# Altium schematic sheet PicoZed.SchDoc: Pico Zed
size A2; DrawnBy: Patrik Staudenmayer; Organization: Altium Limited; Address1: L3, 12a Rodborough Rd; Address2: Frenchs Forest; Address3: NSW; Address4: Australia 2086; DocumentNumber: 3; SheetNumber: 3; SheetTotal: 15
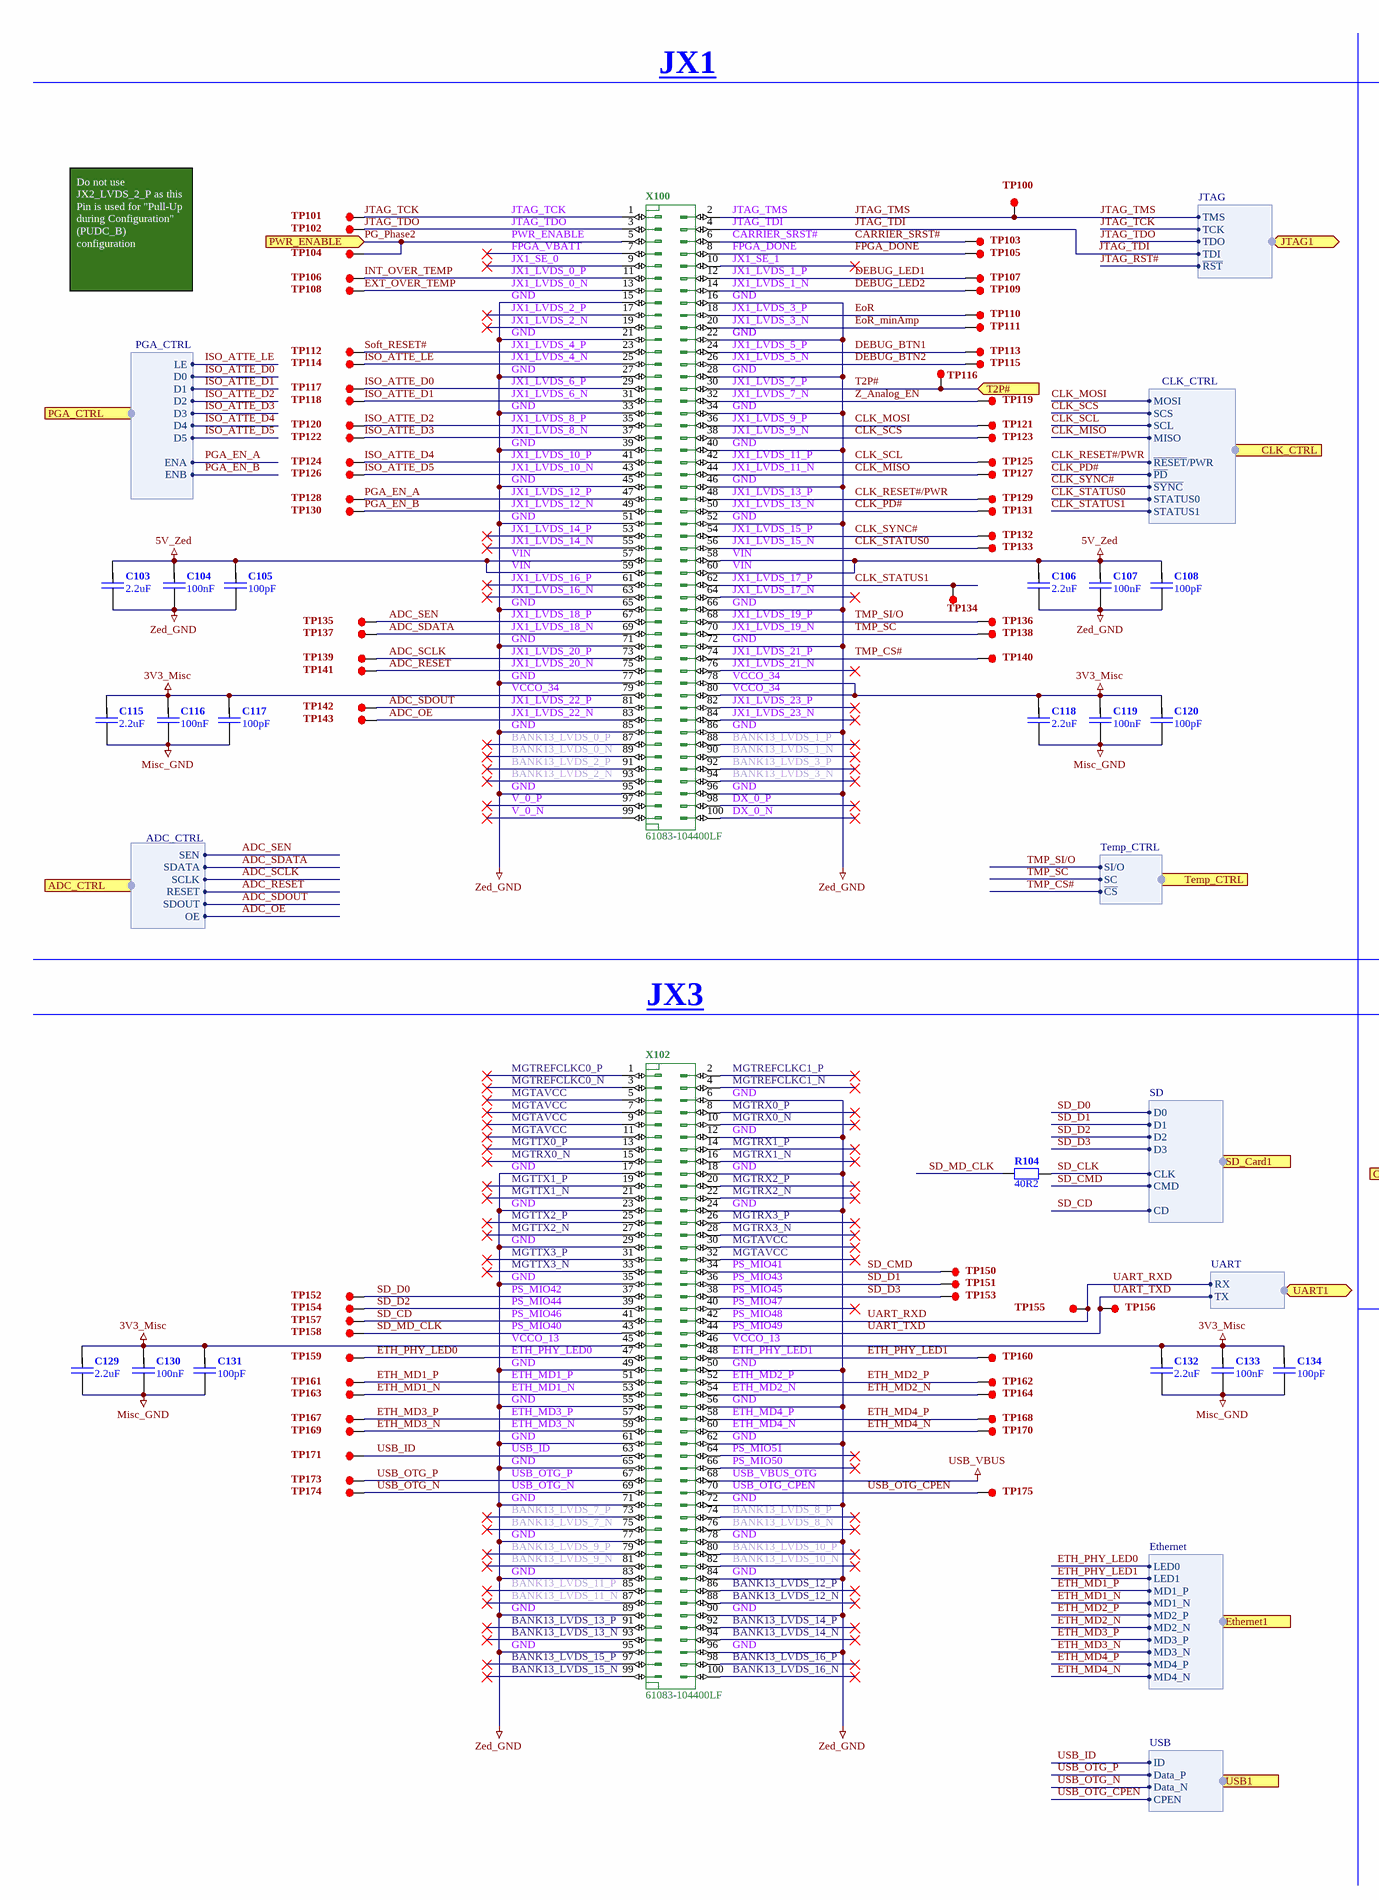
[diagram p0: PicoZed.SchDoc, left]
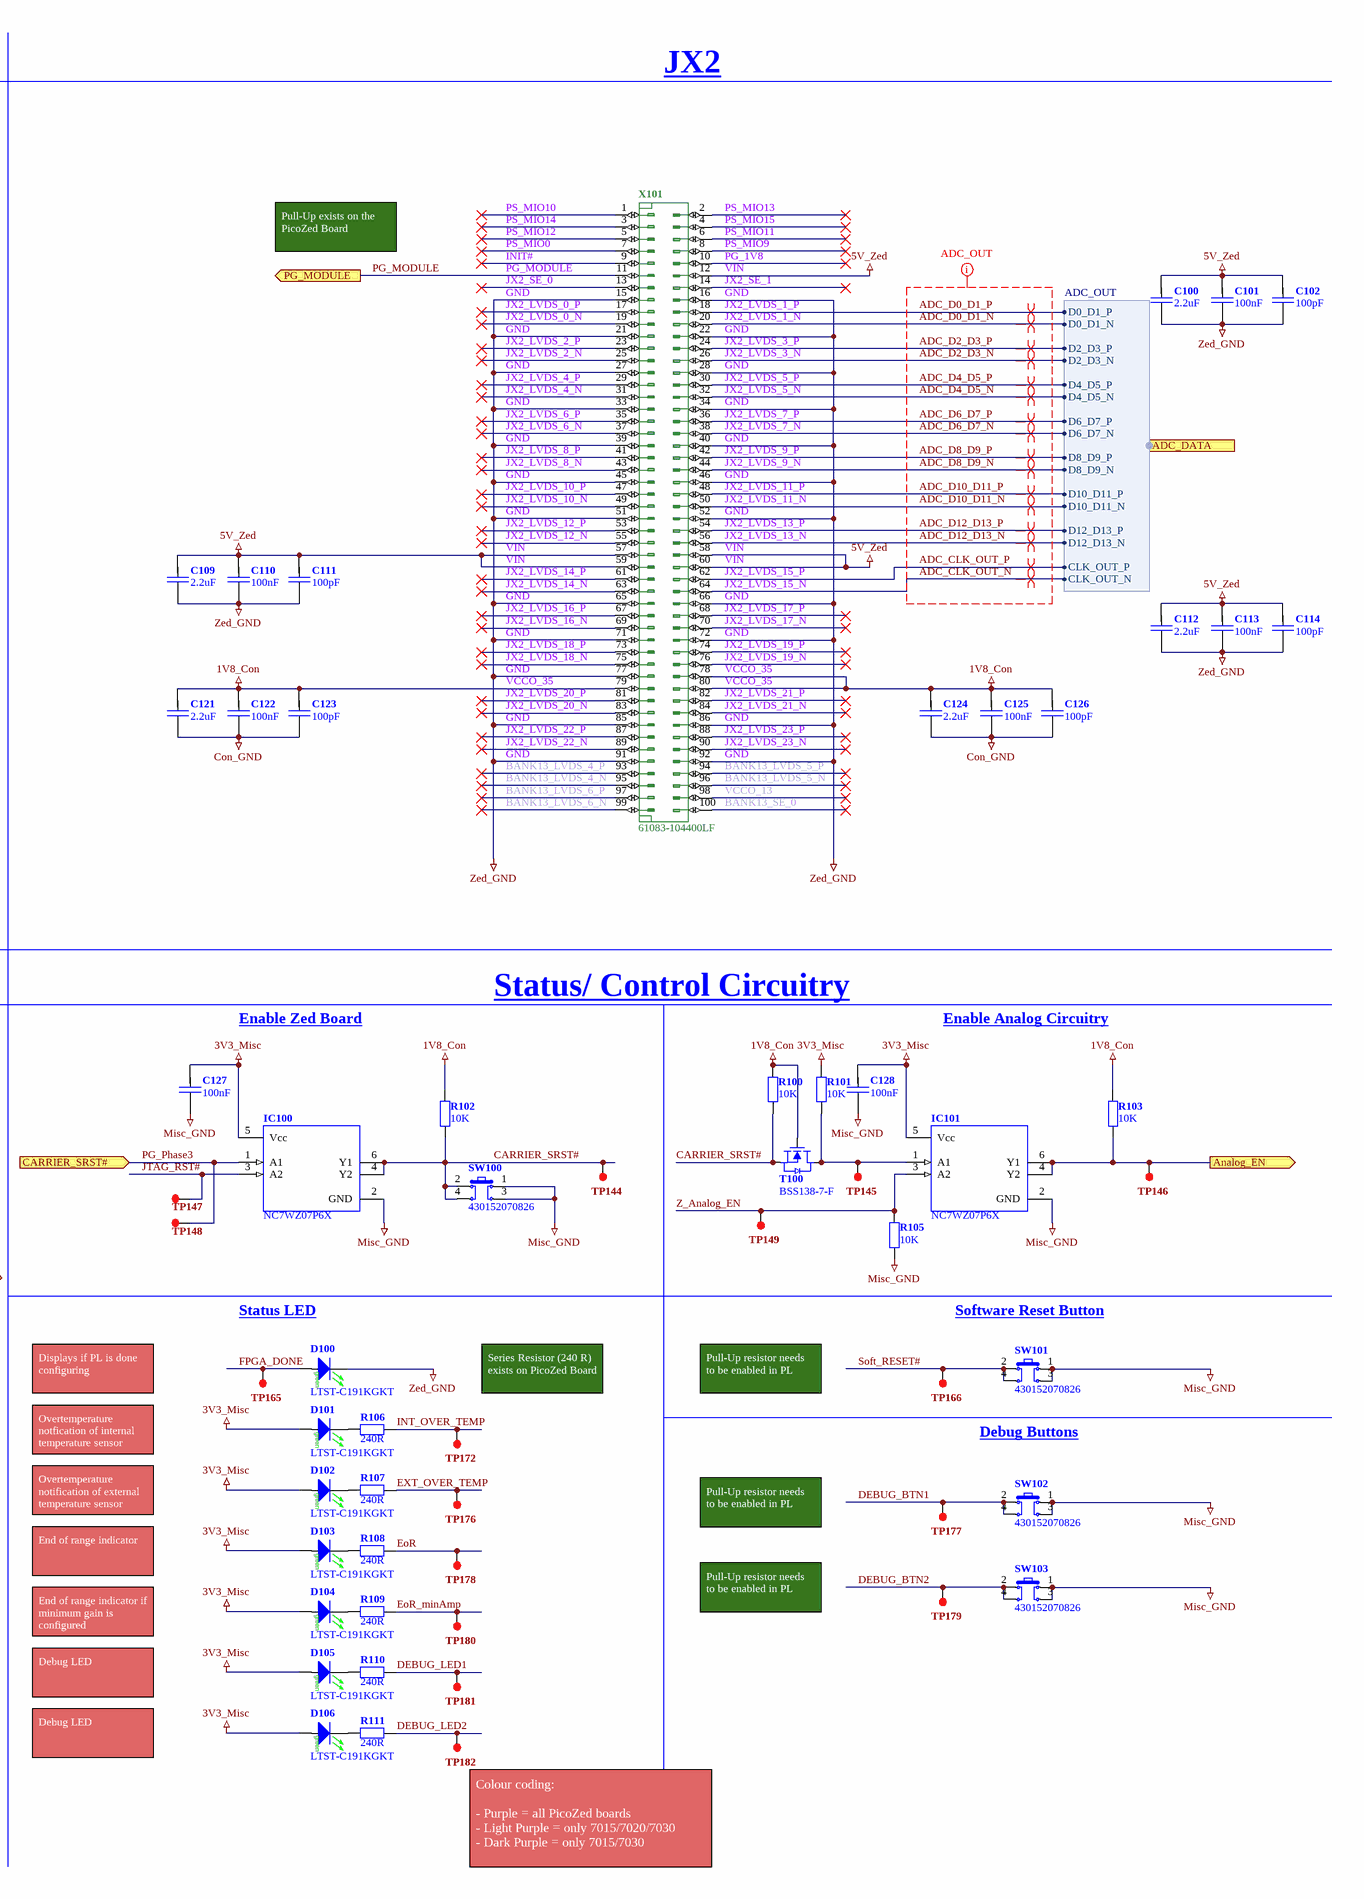
[diagram p1: PicoZed.SchDoc, right]

## Parts
C100  2.2uF  [C_1206_N [CAPC3216N IPC]]
C101  100nF  [C_0805_N [CAPC2013N IPC]]
C102  100pF  [C_0603_N [CAPC1608N IPC]]
C103  2.2uF  [C_1206_N [CAPC3216N IPC]]
C104  100nF  [C_0805_N [CAPC2013N IPC]]
C105  100pF  [C_0603_N [CAPC1608N IPC]]
C106  2.2uF  [C_1206_N [CAPC3216N IPC]]
C107  100nF  [C_0805_N [CAPC2013N IPC]]
C108  100pF  [C_0603_N [CAPC1608N IPC]]
C109  2.2uF  [C_1206_N [CAPC3216N IPC]]
C110  100nF  [C_0805_N [CAPC2013N IPC]]
C111  100pF  [C_0603_N [CAPC1608N IPC]]
C112  2.2uF  [C_1206_N [CAPC3216N IPC]]
C113  100nF  [C_0805_N [CAPC2013N IPC]]
C114  100pF  [C_0603_N [CAPC1608N IPC]]
C115  2.2uF  [C_1206_N [CAPC3216N IPC]]
C116  100nF  [C_0805_N [CAPC2013N IPC]]
C117  100pF  [C_0603_N [CAPC1608N IPC]]
C118  2.2uF  [C_1206_N [CAPC3216N IPC]]
C119  100nF  [C_0805_N [CAPC2013N IPC]]
C120  100pF  [C_0603_N [CAPC1608N IPC]]
C121  2.2uF  [C_1206_N [CAPC3216N IPC]]
C122  100nF  [C_0805_N [CAPC2013N IPC]]
C123  100pF  [C_0603_N [CAPC1608N IPC]]
C124  2.2uF  [C_1206_N [CAPC3216N IPC]]
C125  100nF  [C_0805_N [CAPC2013N IPC]]
C126  100pF  [C_0603_N [CAPC1608N IPC]]
C127  100nF  [C_0603_N [CAPC1608N IPC]]
C128  100nF  [C_0603_N [CAPC1608N IPC]]
C129  2.2uF  [C_1206_N [CAPC3216N IPC]]
C130  100nF  [C_0805_N [CAPC2013N IPC]]
C131  100pF  [C_0603_N [CAPC1608N IPC]]
C132  2.2uF  [C_1206_N [CAPC3216N IPC]]
C133  100nF  [C_0805_N [CAPC2013N IPC]]
C134  100pF  [C_0603_N [CAPC1608N IPC]]
D100  LTST-C191KGKT  [LED_0603-GREEN_N_AK]
D101  LTST-C191KGKT  [LED_0603-GREEN_N_AK]
D102  LTST-C191KGKT  [LED_0603-GREEN_N_AK]
D103  LTST-C191KGKT  [LED_0603-GREEN_N_AK]
D104  LTST-C191KGKT  [LED_0603-GREEN_N_AK]
D105  LTST-C191KGKT  [LED_0603-GREEN_N_AK]
D106  LTST-C191KGKT  [LED_0603-GREEN_N_AK]
IC100  NC7WZ07P6X  [TSOP65P210X110-6N IPC]
IC101  NC7WZ07P6X  [TSOP65P210X110-6N IPC]
R100  10K  [R_0603_N [RESC1608N IPC]]
R101  10K  [R_0603_N [RESC1608N IPC]]
R102  10K  [R_0603_N [RESC1608N IPC]]
R103  10K  [R_0603_N [RESC1608N IPC]]
R104  40R2  [R_0603_M [RESC1608M IPC]]
R105  10K  [R_0603_N [RESC1608N IPC]]
R106  240R  [R_0603_N [RESC1608N IPC]]
R107  240R  [R_0603_N [RESC1608N IPC]]
R108  240R  [R_0603_N [RESC1608N IPC]]
R109  240R  [R_0603_N [RESC1608N IPC]]
R110  240R  [R_0603_N [RESC1608N IPC]]
R111  240R  [R_0603_N [RESC1608N IPC]]
SW100  430152070826  [SW_430152070826]
SW101  430152070826  [SW_430152070826]
SW102  430152070826  [SW_430152070826]
SW103  430152070826  [SW_430152070826]
T100  BSS138-7-F  [SOT105P235X102-3N IPC]
TP100  TP_GENERIC  [TP_0.8_P100T]  (value not drawn)  (no BOM)
TP101  TP_GENERIC  [TP_0.8_P100T]  (value not drawn)  (no BOM)
TP102  TP_GENERIC  [TP_0.8_P100T]  (value not drawn)  (no BOM)
TP103  TP_GENERIC  [TP_0.8_P100T]  (value not drawn)  (no BOM)
TP104  TP_GENERIC  [TP_0.8_P100T]  (value not drawn)  (no BOM)
TP105  TP_GENERIC  [TP_0.8_P100T]  (value not drawn)  (no BOM)
TP106  TP_GENERIC  [TP_0.8_P100T]  (value not drawn)  (no BOM)
TP107  TP_GENERIC  [TP_0.8_P100T]  (value not drawn)  (no BOM)
TP108  TP_GENERIC  [TP_0.8_P100T]  (value not drawn)  (no BOM)
TP109  TP_GENERIC  [TP_0.8_P100T]  (value not drawn)  (no BOM)
TP110  TP_GENERIC  [TP_0.8_P100T]  (value not drawn)  (no BOM)
TP111  TP_GENERIC  [TP_0.8_P100T]  (value not drawn)  (no BOM)
TP112  TP_GENERIC  [TP_0.8_P100T]  (value not drawn)  (no BOM)
TP113  TP_GENERIC  [TP_0.8_P100T]  (value not drawn)  (no BOM)
TP114  TP_GENERIC  [TP_0.8_P100T]  (value not drawn)  (no BOM)
TP115  TP_GENERIC  [TP_0.8_P100T]  (value not drawn)  (no BOM)
TP116  TP_GENERIC  [TP_0.8_P100T]  (value not drawn)  (no BOM)
TP117  TP_GENERIC  [TP_0.8_P100T]  (value not drawn)  (no BOM)
TP118  TP_GENERIC  [TP_0.8_P100T]  (value not drawn)  (no BOM)
TP119  TP_GENERIC  [TP_0.8_P100T]  (value not drawn)  (no BOM)
TP120  TP_GENERIC  [TP_0.8_P100T]  (value not drawn)  (no BOM)
TP121  TP_GENERIC  [TP_0.8_P100T]  (value not drawn)  (no BOM)
TP122  TP_GENERIC  [TP_0.8_P100T]  (value not drawn)  (no BOM)
TP123  TP_GENERIC  [TP_0.8_P100T]  (value not drawn)  (no BOM)
TP124  TP_GENERIC  [TP_0.8_P100T]  (value not drawn)  (no BOM)
TP125  TP_GENERIC  [TP_0.8_P100T]  (value not drawn)  (no BOM)
TP126  TP_GENERIC  [TP_0.8_P100T]  (value not drawn)  (no BOM)
TP127  TP_GENERIC  [TP_0.8_P100T]  (value not drawn)  (no BOM)
TP128  TP_GENERIC  [TP_0.8_P100T]  (value not drawn)  (no BOM)
TP129  TP_GENERIC  [TP_0.8_P100T]  (value not drawn)  (no BOM)
TP130  TP_GENERIC  [TP_0.8_P100T]  (value not drawn)  (no BOM)
TP131  TP_GENERIC  [TP_0.8_P100T]  (value not drawn)  (no BOM)
TP132  TP_GENERIC  [TP_0.8_P100T]  (value not drawn)  (no BOM)
TP133  TP_GENERIC  [TP_0.8_P100T]  (value not drawn)  (no BOM)
TP134  TP_GENERIC  [TP_0.8_P100T]  (value not drawn)  (no BOM)
TP135  TP_GENERIC  [TP_0.8_P100T]  (value not drawn)  (no BOM)
TP136  TP_GENERIC  [TP_0.8_P100T]  (value not drawn)  (no BOM)
TP137  TP_GENERIC  [TP_0.8_P100T]  (value not drawn)  (no BOM)
TP138  TP_GENERIC  [TP_0.8_P100T]  (value not drawn)  (no BOM)
TP139  TP_GENERIC  [TP_0.8_P100T]  (value not drawn)  (no BOM)
TP140  TP_GENERIC  [TP_0.8_P100T]  (value not drawn)  (no BOM)
TP141  TP_GENERIC  [TP_0.8_P100T]  (value not drawn)  (no BOM)
TP142  TP_GENERIC  [TP_0.8_P100T]  (value not drawn)  (no BOM)
TP143  TP_GENERIC  [TP_0.8_P100T]  (value not drawn)  (no BOM)
TP144  TP_GENERIC  [TP_0.8_P100T]  (value not drawn)  (no BOM)
TP145  TP_GENERIC  [TP_0.8_P100T]  (value not drawn)  (no BOM)
TP146  TP_GENERIC  [TP_0.8_P100T]  (value not drawn)  (no BOM)
TP147  TP_GENERIC  [TP_0.8_P100T]  (value not drawn)  (no BOM)
TP148  TP_GENERIC  [TP_0.8_P100T]  (value not drawn)  (no BOM)
TP149  TP_GENERIC  [TP_0.8_P100T]  (value not drawn)  (no BOM)
TP150  TP_GENERIC  [TP_0.8_P100T]  (value not drawn)  (no BOM)
TP151  TP_GENERIC  [TP_0.8_P100T]  (value not drawn)  (no BOM)
TP152  TP_GENERIC  [TP_0.8_P100T]  (value not drawn)  (no BOM)
TP153  TP_GENERIC  [TP_0.8_P100T]  (value not drawn)  (no BOM)
TP154  TP_GENERIC  [TP_0.8_P100T]  (value not drawn)  (no BOM)
TP155  TP_GENERIC  [TP_0.8_P100T]  (value not drawn)  (no BOM)
TP156  TP_GENERIC  [TP_0.8_P100T]  (value not drawn)  (no BOM)
TP157  TP_GENERIC  [TP_0.8_P100T]  (value not drawn)  (no BOM)
TP158  TP_GENERIC  [TP_0.8_P100T]  (value not drawn)  (no BOM)
TP159  TP_GENERIC  [TP_0.8_P100T]  (value not drawn)  (no BOM)
TP160  TP_GENERIC  [TP_0.8_P100T]  (value not drawn)  (no BOM)
TP161  TP_GENERIC  [TP_0.8_P100T]  (value not drawn)  (no BOM)
TP162  TP_GENERIC  [TP_0.8_P100T]  (value not drawn)  (no BOM)
TP163  TP_GENERIC  [TP_0.8_P100T]  (value not drawn)  (no BOM)
TP164  TP_GENERIC  [TP_0.8_P100T]  (value not drawn)  (no BOM)
TP165  TP_GENERIC  [TP_0.8_P100T]  (value not drawn)  (no BOM)
TP166  TP_GENERIC  [TP_0.8_P100T]  (value not drawn)  (no BOM)
TP167  TP_GENERIC  [TP_0.8_P100T]  (value not drawn)  (no BOM)
TP168  TP_GENERIC  [TP_0.8_P100T]  (value not drawn)  (no BOM)
TP169  TP_GENERIC  [TP_0.8_P100T]  (value not drawn)  (no BOM)
TP170  TP_GENERIC  [TP_0.8_P100T]  (value not drawn)  (no BOM)
TP171  TP_GENERIC  [TP_0.8_P100T]  (value not drawn)  (no BOM)
TP172  TP_GENERIC  [TP_0.8_P100T]  (value not drawn)  (no BOM)
TP173  TP_GENERIC  [TP_0.8_P100T]  (value not drawn)  (no BOM)
TP174  TP_GENERIC  [TP_0.8_P100T]  (value not drawn)  (no BOM)
TP175  TP_GENERIC  [TP_0.8_P100T]  (value not drawn)  (no BOM)
TP176  TP_GENERIC  [TP_0.8_P100T]  (value not drawn)  (no BOM)
TP177  TP_GENERIC  [TP_0.8_P100T]  (value not drawn)  (no BOM)
TP178  TP_GENERIC  [TP_0.8_P100T]  (value not drawn)  (no BOM)
TP179  TP_GENERIC  [TP_0.8_P100T]  (value not drawn)  (no BOM)
TP180  TP_GENERIC  [TP_0.8_P100T]  (value not drawn)  (no BOM)
TP181  TP_GENERIC  [TP_0.8_P100T]  (value not drawn)  (no BOM)
TP182  TP_GENERIC  [TP_0.8_P100T]  (value not drawn)  (no BOM)
X100  61083-104400LF  [X_61083-104400LF]
X101  61083-104400LF  [X_61083-104400LF]
X102  61083-104400LF  [X_61083-104400LF]

## Ports
ADC_CTRL (harness ADC_CTRL), ADC_DATA (harness ADC_OUT), Analog_EN (out), CARRIER_SRST# (in), CLK_CTRL (harness CLK_CTRL), Ethernet1 (harness Ethernet), JTAG1 (bidir, harness JTAG), PG_MODULE (out), PGA_CTRL (harness PGA_CTRL), PWR_ENABLE (in), SD_Card1 (harness SD), T2P# (in), Temp_CTRL (in, harness Temp_CTRL), UART1 (bidir, harness UART), USB1 (harness USB)

## Harnesses
SD: CLK, D0, D1, D2, D3, CD, CMD
USB: ID, Data_P, Data_N, CPEN
Ethernet: LED0, LED1, MD1_P, MD1_N, MD2_P, MD2_N, MD3_P, MD3_N, MD4_P, MD4_N
JTAG: TMS, TCK, TDI, TDO, ~{RST}
UART: TX, RX
ADC_OUT: D0_D1_N, D0_D1_P, D2_D3_N, D2_D3_P, D4_D5_N, D4_D5_P, D6_D7_N, D6_D7_P, D8_D9_N, D8_D9_P, D10_D11_N, D10_D11_P, D12_D13_N, D12_D13_P, CLK_OUT_P, CLK_OUT_N
CLK_CTRL: MOSI, SCS, SCL, MISO, ~{RESET}/PWR, ~{PD}, ~{SYNC}, STATUS0, STATUS1
ADC_CTRL: SEN, SDATA, SCLK, RESET, SDOUT, OE
PGA_CTRL: LE, D0, D1, D2, D3, D4, D5, ENA, ENB
Temp_CTRL: SI/O, SC, ~{CS}

## Nets
1V8_Con: C121.1 C122.1 C123.1 C124.1 C125.1 C126.1 R100.2 R102.2 R103.2 T100.G X101.78 X101.79 X101.80
3V3_Misc: C115.1 C116.1 C117.1 C118.1 C119.1 C120.1 C127.1 C128.1 C129.1 C130.1 C131.1 C132.1 C133.1 C134.1 D101.A D102.A D103.A D104.A D105.A D106.A IC100.5(Vcc) IC101.5(Vcc) R101.2 X100.78 X100.79 X100.80 X102.45 X102.46
5V_Zed: C100.1 C101.1 C102.1 C103.1 C104.1 C105.1 C106.1 C107.1 C108.1 C109.1 C110.1 C111.1 C112.1 C113.1 C114.1 X100.57 X100.58 X100.59 X100.60 X101.12 X101.57 X101.58 X101.59 X101.60
Con_GND: C121.2 C122.2 C123.2 C124.2 C125.2 C126.2
Misc_GND: C115.2 C116.2 C117.2 C118.2 C119.2 C120.2 C127.2 C128.2 C129.2 C130.2 C131.2 C132.2 C133.2 C134.2 IC100.2(GND) IC101.2(GND) R105.1 SW100.1 SW100.3 SW101.1 SW101.3 SW102.1 SW102.3 SW103.1 SW103.3
USB_VBUS: X102.68
Zed_GND: C100.2 C101.2 C102.2 C103.2 C104.2 C105.2 C106.2 C107.2 C108.2 C109.2 C110.2 C111.2 C112.2 C113.2 C114.2 D100.K X100.15 X100.16 X100.21 X100.22 X100.27 X100.28 X100.33 X100.34 X100.39 X100.40 X100.45 X100.46 X100.51 X100.52 X100.65 X100.66 X100.71 X100.72 X100.77 X100.85 X100.86 X100.95 X100.96 X101.15 X101.16 X101.21 X101.22 X101.27 X101.28 X101.33 X101.34 X101.39 X101.40 X101.45 X101.46 X101.51 X101.52 X101.65 X101.66 X101.71 X101.72 X101.77 X101.85 X101.86 X101.91 X101.92 X102.6 X102.12 X102.17 X102.18 X102.23 X102.24 X102.29 X102.35 X102.49 X102.50 X102.55 X102.56 X102.61 X102.62 X102.65 X102.71 X102.72 X102.77 X102.78 X102.83 X102.84 X102.89 X102.90 X102.95 X102.96
ADC_CLK_OUT_N: X101.64 ; port ADC_DATA.CLK_OUT_N
ADC_CLK_OUT_P: X101.62 ; port ADC_DATA.CLK_OUT_P
ADC_D0_D1_N: X101.20 ; port ADC_DATA.D0_D1_N
ADC_D0_D1_P: X101.18 ; port ADC_DATA.D0_D1_P
ADC_D2_D3_N: X101.26 ; port ADC_DATA.D2_D3_N
ADC_D2_D3_P: X101.24 ; port ADC_DATA.D2_D3_P
ADC_D4_D5_N: X101.32 ; port ADC_DATA.D4_D5_N
ADC_D4_D5_P: X101.30 ; port ADC_DATA.D4_D5_P
ADC_D6_D7_N: X101.38 ; port ADC_DATA.D6_D7_N
ADC_D6_D7_P: X101.36 ; port ADC_DATA.D6_D7_P
ADC_D8_D9_N: X101.44 ; port ADC_DATA.D8_D9_N
ADC_D8_D9_P: X101.42 ; port ADC_DATA.D8_D9_P
ADC_D10_D11_N: X101.50 ; port ADC_DATA.D10_D11_N
ADC_D10_D11_P: X101.48 ; port ADC_DATA.D10_D11_P
ADC_D12_D13_N: X101.56 ; port ADC_DATA.D12_D13_N
ADC_D12_D13_P: X101.54 ; port ADC_DATA.D12_D13_P
ADC_OE: TP143.1 X100.83 ; port ADC_CTRL.OE
ADC_RESET: TP141.1 X100.75 ; port ADC_CTRL.RESET
ADC_SCLK: TP139.1 X100.73 ; port ADC_CTRL.SCLK
ADC_SDATA: TP137.1 X100.69 ; port ADC_CTRL.SDATA
ADC_SDOUT: TP142.1 X100.81 ; port ADC_CTRL.SDOUT
ADC_SEN: TP135.1 X100.67 ; port ADC_CTRL.SEN
Analog_EN: IC101.4(Y2) IC101.6(Y1) R103.1 TP146.1 ; port Analog_EN
CARRIER_SRST#: IC100.4(Y2) IC100.6(Y1) R100.1 R102.1 SW100.2 SW100.4 T100.S TP103.1 TP144.1 X100.6
CLK_MISO: TP127.1 X100.44 ; port CLK_CTRL.MISO
CLK_MOSI: TP121.1 X100.36 ; port CLK_CTRL.MOSI
CLK_PD#: TP131.1 X100.50 ; port CLK_CTRL.~{PD}
CLK_RESET#/PWR: TP129.1 X100.48 ; port CLK_CTRL.~{RESET}/PWR
CLK_SCL: TP125.1 X100.42 ; port CLK_CTRL.SCL
CLK_SCS: TP123.1 X100.38 ; port CLK_CTRL.SCS
CLK_STATUS0: TP133.1 X100.56 ; port CLK_CTRL.STATUS0
CLK_STATUS1: TP134.1 X100.62 ; port CLK_CTRL.STATUS1
CLK_SYNC#: TP132.1 X100.54 ; port CLK_CTRL.~{SYNC}
DEBUG_BTN1: SW102.2 SW102.4 TP113.1 TP177.1 X100.24
DEBUG_BTN2: SW103.2 SW103.4 TP115.1 TP179.1 X100.26
DEBUG_LED1: R110.1 TP107.1 TP181.1 X100.12
DEBUG_LED2: R111.1 TP109.1 TP182.1 X100.14
EoR: R108.1 TP110.1 TP178.1 X100.18
EoR_minAmp: R109.1 TP111.1 TP180.1 X100.20
ETH_MD1_N: TP163.1 X102.53 ; port Ethernet1.MD1_N
ETH_MD1_P: TP161.1 X102.51 ; port Ethernet1.MD1_P
ETH_MD2_N: TP164.1 X102.54 ; port Ethernet1.MD2_N
ETH_MD2_P: TP162.1 X102.52 ; port Ethernet1.MD2_P
ETH_MD3_N: TP169.1 X102.59 ; port Ethernet1.MD3_N
ETH_MD3_P: TP167.1 X102.57 ; port Ethernet1.MD3_P
ETH_MD4_N: TP170.1 X102.60 ; port Ethernet1.MD4_N
ETH_MD4_P: TP168.1 X102.58 ; port Ethernet1.MD4_P
ETH_PHY_LED0: TP159.1 X102.47 ; port Ethernet1.LED0
ETH_PHY_LED1: TP160.1 X102.48 ; port Ethernet1.LED1
EXT_OVER_TEMP: R107.1 TP108.1 TP176.1 X100.13
FPGA_DONE: D100.A TP105.1 TP165.1 X100.8
INT_OVER_TEMP: R106.1 TP106.1 TP172.1 X100.11
ISO_ATTE_D0: TP117.1 X100.29 ; port PGA_CTRL.D0
ISO_ATTE_D1: TP118.1 X100.31 ; port PGA_CTRL.D1
ISO_ATTE_D2: TP120.1 X100.35 ; port PGA_CTRL.D2
ISO_ATTE_D3: TP122.1 X100.37 ; port PGA_CTRL.D3
ISO_ATTE_D4: TP124.1 X100.41 ; port PGA_CTRL.D4
ISO_ATTE_D5: TP126.1 X100.43 ; port PGA_CTRL.D5
ISO_ATTE_LE: TP114.1 X100.25 ; port PGA_CTRL.LE
JTAG_RST#: IC100.3(A2) TP147.1 ; port JTAG1.~{RST}
JTAG_TCK: TP101.1 X100.1 ; port JTAG1.TCK
JTAG_TDI: X100.4 ; port JTAG1.TDI
JTAG_TDO: TP102.1 X100.3 ; port JTAG1.TDO
JTAG_TMS: TP100.1 X100.2 ; port JTAG1.TMS
PG_MODULE: X101.11 ; port PG_MODULE
PG_Phase2: TP104.1 X100.5 ; port PWR_ENABLE
PG_Phase3: IC100.1(A1) TP148.1 ; port CARRIER_SRST#
PGA_EN_A: TP128.1 X100.47 ; port PGA_CTRL.ENA
PGA_EN_B: TP130.1 X100.49 ; port PGA_CTRL.ENB
SD_CD: TP157.1 X102.41 ; port SD_Card1.CD
SD_CLK: R104.1 ; port SD_Card1.CLK
SD_CMD: TP150.1 X102.34 ; port SD_Card1.CMD
SD_D0: TP152.1 X102.37 ; port SD_Card1.D0
SD_D1: TP151.1 X102.36 ; port SD_Card1.D1
SD_D2: TP154.1 X102.39 ; port SD_Card1.D2
SD_D3: TP153.1 X102.38 ; port SD_Card1.D3
SD_MD_CLK: R104.2 TP158.1 X102.43
Soft_RESET#: SW101.2 SW101.4 TP112.1 TP166.1 X100.23
T2P#: TP116.1 X100.30 ; port T2P#
TMP_CS#: TP140.1 X100.74 ; port Temp_CTRL.~{CS}
TMP_SC: TP138.1 X100.70 ; port Temp_CTRL.SC
TMP_SI/O: TP136.1 X100.68 ; port Temp_CTRL.SI/O
UART_RXD: TP155.1 X102.42 ; port UART1.RX
UART_TXD: TP156.1 X102.44 ; port UART1.TX
USB_ID: TP171.1 X102.63 ; port USB1.ID
USB_OTG_CPEN: TP175.1 X102.70 ; port USB1.CPEN
USB_OTG_N: TP174.1 X102.69 ; port USB1.Data_N
USB_OTG_P: TP173.1 X102.67 ; port USB1.Data_P
Z_Analog_EN: IC101.3(A2) R105.2 TP119.1 TP149.1 X100.32
NetD101_K: D101.K R106.2
NetD102_K: D102.K R107.2
NetD103_K: D103.K R108.2
NetD104_K: D104.K R109.2
NetD105_K: D105.K R110.2
NetD106_K: D106.K R111.2
NetIC101_1: IC101.1(A1) R101.1 T100.D TP145.1

Not connected (* = marked no-connect by the designer): X100 7* 9* 10* 17* 19* 53* 55* 61* 63* 64* 76* 82* 84* 87* 88* 89* 90* 91* 92* 93* 94* 97* 98* 99* 100*; X101 1* 2* 3* 4* 5* 6* 7* 8* 9* 10* 13* 14* 17* 19* 23* 25* 29* 31* 35* 37* 41* 43* 47* 49* 53* 55* 61* 63* 67* 68* 69* 70* 73* 74* 75* 76* 81* 82* 83* 84* 87* 88* 89* 90* 93* 94* 95* 96* 97* 98* 99* 100*; X102 1* 2* 3* 4* 5* 7* 8* 9* 10* 11* 13* 14* 15* 16* 19* 20* 21* 22* 25* 26* 27* 28* 30* 31* 32* 33* 40* 64* 66* 73* 74* 75* 76* 79* 80* 81* 82* 85* 86* 87* 88* 91* 92* 93* 94* 97* 98* 99* 100*

## Layout directives
differential pair: ADC_CLK_OUT_N, ADC_CLK_OUT_P, ADC_D0_D1_N, ADC_D0_D1_P, ADC_D2_D3_N, ADC_D2_D3_P, ADC_D4_D5_N, ADC_D4_D5_P, ADC_D6_D7_N, ADC_D6_D7_P, ADC_D8_D9_N, ADC_D8_D9_P, ADC_D10_D11_N, ADC_D10_D11_P, ADC_D12_D13_N, ADC_D12_D13_P
rule Maximum Via Count Constraint [Max Count = 2]; rule Differential Pairs Routing [Pref Gap = 5mil    Min Gap  = 5mil    Max Gap  = 5milPref Width = 4.138mil    Min Width  = 2.925mil    Max Width  = 4.138mil]; rule Matched Net Lengths [Tolerance = 25mil]; net class ADC_OUT: ADC_CLK_OUT_N, ADC_CLK_OUT_P, ADC_D0_D1_N, ADC_D0_D1_P, ADC_D2_D3_N, ADC_D2_D3_P, ADC_D4_D5_N, ADC_D4_D5_P, ADC_D6_D7_N, ADC_D6_D7_P, ADC_D8_D9_N, ADC_D8_D9_P, ADC_D10_D11_N, ADC_D10_D11_P, ADC_D12_D13_N, ADC_D12_D13_P

## Notes on the sheet
- JX1
- JX2
- JTAG_TCK
- JTAG_TDO
- (near X100) JTAG_TMS
- (near X100) JTAG_TDI
- PS_MIO10
- PS_MIO14
- (near X101) PS_MIO13
- (near X101) PS_MIO15
- Do not use JX2_LVDS_2_P as this Pin is used for "Pull-Up during Configuration" (PUDC_B) configuration
- PWR_ENABLE
- FPGA_VBATT
- JX1_SE_0
- JX1_LVDS_0_P
- JX1_LVDS_0_N
- (near X100) CARRIER_SRST#
- (near X100) FPGA_DONE
- (near X100) JX1_SE_1
- (near X100) JX1_LVDS_1_P
- (near X100) JX1_LVDS_1_N
- Pull-Up exists on the PicoZed Board
- PS_MIO12
- PS_MIO0
- INIT#
- PG_MODULE
- JX2_SE_0
- (near X101) VIN
- (near X101) PS_MIO11
- (near X101) PS_MIO9
- (near X101) PG_1V8
- (near X101) JX2_SE_1
- GND
- JX1_LVDS_2_P
- JX1_LVDS_2_N
- JX1_LVDS_4_P
- (near X100) GND
- (near X100) JX1_LVDS_3_P
- (near X100) JX1_LVDS_3_N
- (near X100) JX1_LVDS_5_P
- JX2_LVDS_0_P
- JX2_LVDS_0_N
- JX2_LVDS_2_P
- (near X101) GND
- (near X101) JX2_LVDS_1_P
- (near X101) JX2_LVDS_1_N
- (near X101) JX2_LVDS_3_P
- JX1_LVDS_4_N
- JX1_LVDS_6_P
- JX1_LVDS_6_N
- (near X100) JX1_LVDS_5_N
- (near X100) JX1_LVDS_7_P
- (near X100) JX1_LVDS_7_N
- JX2_LVDS_2_N
- JX2_LVDS_4_P
- JX2_LVDS_4_N
- (near X101) JX2_LVDS_3_N
- (near X101) JX2_LVDS_5_P
- (near X101) JX2_LVDS_5_N
- JX1_LVDS_8_P
- JX1_LVDS_8_N
- JX1_LVDS_10_P
- JX1_LVDS_10_N
- (near X100) JX1_LVDS_9_P
- (near X100) JX1_LVDS_9_N
- (near X100) JX1_LVDS_11_P
- (near X100) JX1_LVDS_11_N
- JX2_LVDS_6_P
- JX2_LVDS_6_N
- JX2_LVDS_8_P
- JX2_LVDS_8_N
- (near X101) JX2_LVDS_7_P
- (near X101) JX2_LVDS_7_N
- (near X101) JX2_LVDS_9_P
- (near X101) JX2_LVDS_9_N
- JX1_LVDS_12_P
- JX1_LVDS_12_N
- JX1_LVDS_14_P
- (near X100) JX1_LVDS_13_N
- (near X100) JX1_LVDS_13_P
- (near X100) JX1_LVDS_15_P
- JX2_LVDS_10_P
- JX2_LVDS_10_N
- JX2_LVDS_12_P
- (near X101) JX2_LVDS_11_P
- (near X101) JX2_LVDS_11_N
- (near X101) JX2_LVDS_13_P
- VIN
- JX1_LVDS_14_N
- JX1_LVDS_16_P
- JX1_LVDS_16_N
- (near X100) VIN
- (near X100) JX1_LVDS_15_N
- (near X100) JX1_LVDS_17_P
- (near X100) JX1_LVDS_17_N
- JX2_LVDS_12_N
- JX2_LVDS_14_P
- JX2_LVDS_14_N
- (near X101) JX2_LVDS_13_N
- (near X101) JX2_LVDS_15_P
- (near X101) JX2_LVDS_15_N
- JX1_LVDS_18_P
- JX1_LVDS_18_N
- JX1_LVDS_20_P
- (near X100) JX1_LVDS_19_P
- (near X100) JX1_LVDS_19_N
- (near X100) JX1_LVDS_21_P
- JX2_LVDS_16_P
- JX2_LVDS_16_N
- JX2_LVDS_18_P
- (near X101) JX2_LVDS_17_P
- (near X101) JX2_LVDS_17_N
- (near X101) JX2_LVDS_19_P
- VCCO_34
- JX1_LVDS_20_N
- JX1_LVDS_22_P
- JX1_LVDS_22_N
- (near X100) VCCO_34
- (near X100) JX1_LVDS_21_N
- (near X100) JX1_LVDS_23_P
- (near X100) JX1_LVDS_23_N
- VCCO_35
- JX2_LVDS_18_N
- JX2_LVDS_20_P
- JX2_LVDS_20_N
- (near X101) VCCO_35
- (near X101) JX2_LVDS_19_N
- (near X101) JX2_LVDS_21_P
- (near X101) JX2_LVDS_21_N
- BANK13_LVDS_0_P
- BANK13_LVDS_0_N
- BANK13_LVDS_2_P
- BANK13_LVDS_2_N
- (near X100) BANK13_LVDS_1_P
- (near X100) BANK13_LVDS_1_N
- (near X100) BANK13_LVDS_3_P
- (near X100) BANK13_LVDS_3_N
- JX2_LVDS_22_P
- JX2_LVDS_22_N
- BANK13_LVDS_4_P
- (near X101) JX2_LVDS_23_P
- (near X101) JX2_LVDS_23_N
- (near X101) BANK13_LVDS_5_P
- V_0_P
- V_0_N
- (near X100) DX_0_P
- (near X100) DX_0_N
- BANK13_LVDS_4_N
- BANK13_LVDS_6_P
- BANK13_LVDS_6_N
- (near X101) VCCO_13
- (near X101) BANK13_LVDS_5_N
- (near X101) BANK13_SE_0
- JX3
- Status/ Control Circuitry
- MGTREFCLKC0_P
- MGTREFCLKC0_N
- (near X102) MGTREFCLKC1_P
- (near X102) MGTREFCLKC1_N
- Enable Zed Board
- Enable Analog Circuitry
- MGTAVCC
- MGTTX0_P
- (near X102) GND
- (near X102) MGTRX0_P
- (near X102) MGTRX0_N
- (near X102) MGTRX1_P
- MGTRX0_N
- MGTTX1_P
- MGTTX1_N
- (near X102) MGTRX1_N
- (near X102) MGTRX2_P
- (near X102) MGTRX2_N
- MGTTX2_P
- MGTTX2_N
- MGTTX3_P
- MGTTX3_N
- (near X102) MGTRX3_P
- (near X102) MGTRX3_N
- (near X102) MGTAVCC
- (near X102) PS_MIO41
- PS_MIO42
- PS_MIO44
- PS_MIO46
- PS_MIO40
- (near X102) PS_MIO43
- (near X102) PS_MIO45
- (near X102) PS_MIO47
- (near X102) PS_MIO48
- (near X102) PS_MIO49
- Status LED
- Software Reset Button
- VCCO_13
- ETH_PHY_LED0
- ETH_MD1_P
- ETH_MD1_N
- (near X102) VCCO_13
- (near X102) ETH_PHY_LED1
- (near X102) ETH_MD2_P
- (near X102) ETH_MD2_N
- ETH_MD3_P
- ETH_MD3_N
- USB_ID
- (near X102) ETH_MD4_P
- (near X102) ETH_MD4_N
- (near X102) PS_MIO51
- Displays if PL is done configuring
- Series Resistor (240 R) exists on PicoZed Board
- Pull-Up resistor needs to be enabled in PL
- Debug Buttons
- USB_OTG_P
- USB_OTG_N
- BANK13_LVDS_7_P
- (near X102) PS_MIO50
- (near X102) USB_VBUS_OTG
- (near X102) USB_OTG_CPEN
- (near X102) BANK13_LVDS_8_P
- Overtemperature notfication of internal temperature sensor
- BANK13_LVDS_7_N
- BANK13_LVDS_9_P
- BANK13_LVDS_9_N
- (near X102) BANK13_LVDS_8_N
- (near X102) BANK13_LVDS_10_P
- (near X102) BANK13_LVDS_10_N
- Overtemperature notification of external temperature sensor
- (near X102) BANK13_LVDS_11_P
- (near X102) BANK13_LVDS_11_N
- (near X102) BANK13_LVDS_13_P
- (near X102) BANK13_LVDS_13_N
- (near X102) BANK13_LVDS_12_P
- (near X102) BANK13_LVDS_12_N
- (near X102) BANK13_LVDS_14_P
- (near X102) BANK13_LVDS_14_N
- End of range indicator
- (near X102) BANK13_LVDS_15_P
- (near X102) BANK13_LVDS_15_N
- (near X102) BANK13_LVDS_16_P
- (near X102) BANK13_LVDS_16_N
- End of range indicator if minimum gain is configured
- Debug LED
- (near TP182) Colour coding:
  - Purple = all PicoZed boards
  - Light Purple = only 7015/7020/7030
  - Dark Purple = only 7015/7030
- Project:
- Title:
- Size:
- Date:
- File:
- A2
- Project ID:
- Time:
- Sheet
- Version:
- of
- Variant:
- (in symbol LED_GREEN_GENERIC) green

## Library data of the parts
C100-C134 = C_GENERIC: Prometheus_ID: *; Prometheus_Manufacturer: *
  C100 C103 C106 C109 C112 C115 C118 C121 C124 C129 C132: Prometheus_ManPartNo: 2.2uF; Prometheus_Comment: 2.2uF; Prometheus_CurrentFootprint: C_1206_N [CAPC3216N IPC]
  C101 C104 C107 C110 C113 C116 C119 C122 C125 C130 C133: Prometheus_ManPartNo: 100nF; Prometheus_Comment: 100nF; Prometheus_CurrentFootprint: C_0805_N [CAPC2013N IPC]
  C102 C105 C108 C111 C114 C117 C120 C123 C126 C131 C134: Prometheus_ManPartNo: 100pF; Prometheus_Comment: 100pF; Prometheus_CurrentFootprint: C_0603_N [CAPC1608N IPC]
  C127 C128: Prometheus_ManPartNo: 100nF; Prometheus_Comment: 100nF; Prometheus_CurrentFootprint: C_0603_N [CAPC1608N IPC]
D100-D106 = LED_GREEN_GENERIC: Prometheus_Manufacturer: Lite-On Inc.; Prometheus_ID: *; Prometheus_ManPartNo: LTST-C191KGKT; Prometheus_Comment: LTST-C191KGKT; Prometheus_CurrentFootprint: LED_0603-GREEN_N_AK; ComponentLink1Description: Datasheet; ComponentLink1URL: https://optoelectronics.liteon.com/upload/download/DS22-2000-228/LTST-C191KGKT.PDF
IC100 IC101 = IC_NC7WZ07P6X: UHS Dual Buffer / Open-Drain Outputs / Vcc: 1.65 V to 5.50 V / Power Down High-Impedance Inputs / Outputs; Prometheus_Manufacturer: ON Semiconductor; Prometheus_ManPartNo: NC7WZ07P6X; Prometheus_Comment: NC7WZ07P6X; Prometheus_CurrentFootprint: TSOP65P210X110-6N IPC
R100-R111 = R_GENERIC_DIN: Prometheus_ID: *; Prometheus_Manufacturer: *
  R100-R103 R105: Prometheus_ManPartNo: 10K; Prometheus_Comment: 10K; Prometheus_CurrentFootprint: R_0603_N [RESC1608N IPC]
  R104: Prometheus_ManPartNo: 40R2; Prometheus_Comment: 40R2; Prometheus_CurrentFootprint: R_0603_M [RESC1608M IPC]
  R106-R111: Prometheus_ManPartNo: 240R; Prometheus_Comment: 240R; Prometheus_CurrentFootprint: R_0603_N [RESC1608N IPC]
SW100-SW103 = SW_430152070826: WS-TASV SMT Tactile Switch / Height: 4.6 mm / Actuating Force: 160g; Prometheus_Manufacturer: Wuerth Electronics; Prometheus_ID: *; Prometheus_ManPartNo: 430152070826; Prometheus_Comment: 430152070826; Prometheus_CurrentFootprint: SW_430152070826
T100 = T_NMOS_BSS138-7-F: VDS = 50 V / VDG = 50 V / VGS = +-20 V / ID = 200 mA / VGS_th = typ. 1.2 V / RDS_on = typ. 1.4 OHM; Prometheus_Manufacturer: Diodes Incorporated; Prometheus_ID: *; Prometheus_ManPartNo: BSS138-7-F; Prometheus_Comment: BSS138-7-F; Prometheus_CurrentFootprint: SOT105P235X102-3N IPC; ComponentLink1Description: Datasheet; ComponentLink1URL: https://www.diodes.com/assets/Datasheets/ds30144.pdf
TP100-TP182 = TP_GENERIC: Needle Test Point; Prometheus_ID: *; Prometheus_ManPartNo: TP_GENERIC; Prometheus_Manufacturer: *; Prometheus_Comment: TP_GENERIC; Prometheus_CurrentFootprint: TP_0.8_P100T
X100-X102 = X_61083-104400LF: BergStak® 0.80mm Pitch / Mezzanine Connector / Vertical Header / Double Row / 100 Positions / Height: 7.7mm; Prometheus_Manufacturer: Amphenol ICC; Prometheus_ID: *; Prometheus_ManPartNo: 61083-104400LF; Prometheus_Comment: 61083-104400LF; Prometheus_CurrentFootprint: X_61083-104400LF